# EAGLE design Arduino Arcade Stick (EAGLE 7.2.0)
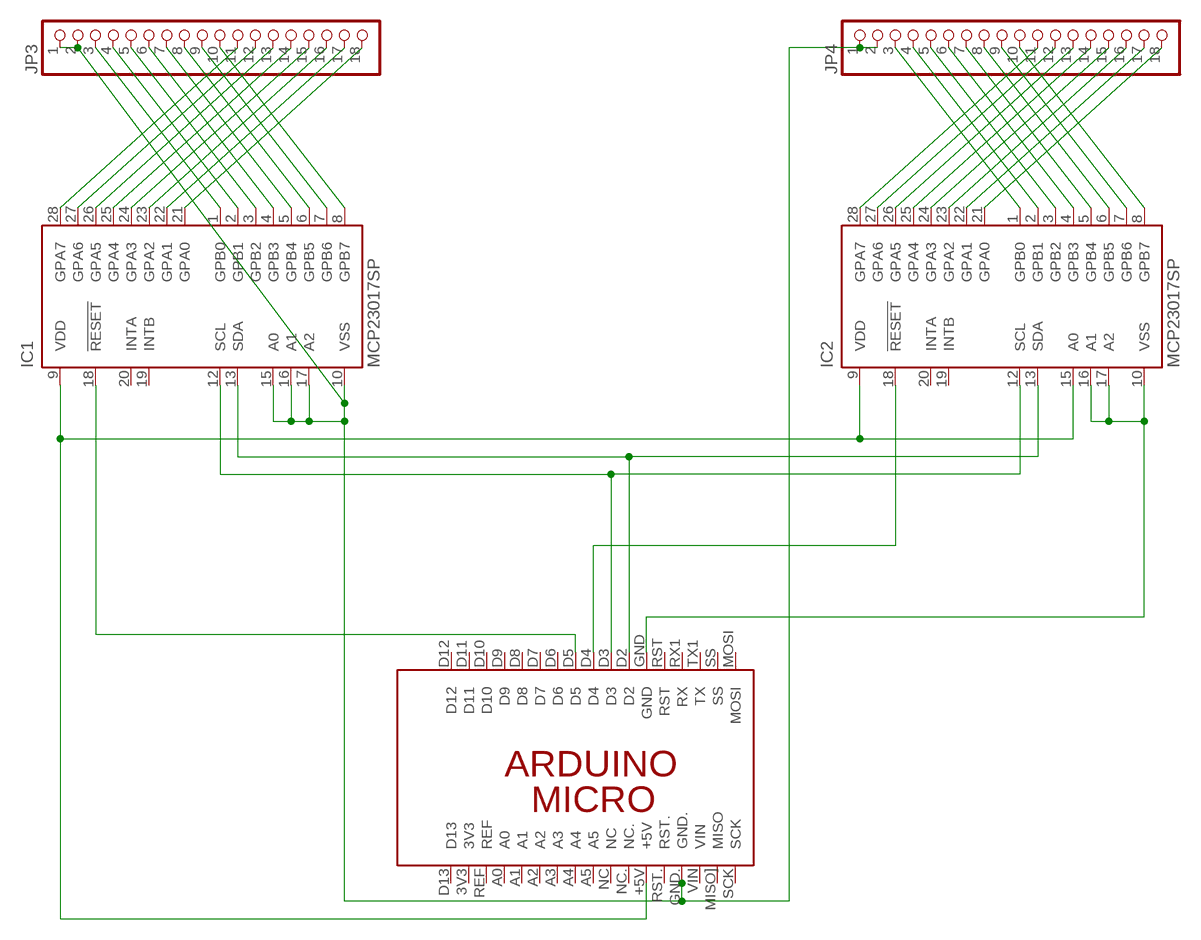
[diagram p0: schematic, sheet 1]

## Parts
IC1  MCP23017SP  [DIL28-3]
IC2  MCP23017SP  [DIL28-3]
JP3  PINHD-1X18  [1X18]
JP4  PINHD-1X18  [1X18]
PCB1  ARDUINO_MICRO  [ARDUINO_MICRO]

## Nets
N$1: IC1.21(GPA0) JP3.18
N$2: IC1.22(GPA1) JP3.17
N$3: IC1.23(GPA2) JP3.16
N$4: IC1.24(GPA3) JP3.15
N$5: IC1.25(GPA4) JP3.14
N$6: IC1.26(GPA5) JP3.13
N$7: IC1.27(GPA6) JP3.12
N$8: IC1.28(GPA7) JP3.11
N$9: IC1.8(GPB7) JP3.10
N$10: IC1.7(GPB6) JP3.9
N$11: IC1.6(GPB5) JP3.8
N$12: IC1.5(GPB4) JP3.7
N$13: IC1.4(GPB3) JP3.6
N$14: IC1.3(GPB2) JP3.5
N$15: IC1.2(GPB1) JP3.4
N$16: IC1.1(GPB0) JP3.3
N$17: IC2.21(GPA0) JP4.18
N$18: IC2.22(GPA1) JP4.17
N$19: IC2.23(GPA2) JP4.16
N$20: IC2.24(GPA3) JP4.15
N$21: IC2.25(GPA4) JP4.14
N$22: IC2.26(GPA5) JP4.13
N$23: IC2.27(GPA6) JP4.12
N$24: IC2.28(GPA7) JP4.11
N$25: IC2.8(GPB7) JP4.10
N$26: IC2.7(GPB6) JP4.9
N$27: IC2.6(GPB5) JP4.8
N$28: IC2.5(GPB4) JP4.7
N$29: IC2.4(GPB3) JP4.6
N$30: IC2.3(GPB2) JP4.5
N$31: IC2.2(GPB1) JP4.4
N$32: IC2.1(GPB0) JP4.3
N$33: IC2.18(!RESET) PCB1.D4
N$34: IC1.13(SDA) IC2.13(SDA) PCB1.D2
N$36: IC1.12(SCL) IC2.12(SCL) PCB1.D3
N$38: IC1.18(!RESET) PCB1.D5
VDD: IC1.9(VDD) IC2.9(VDD) IC2.15(A0) PCB1.+5V
VSS: IC1.10(VSS) IC1.15(A0) IC1.16(A1) IC1.17(A2) IC2.10(VSS) IC2.16(A1) IC2.17(A2) JP3.1 JP3.2 JP4.1 JP4.2 PCB1.GND PCB1.GND.
Unconnected: IC1.19(INTB) IC1.20(INTA) IC2.19(INTB) IC2.20(INTA) PCB1.3V3 PCB1.A0 PCB1.A1 PCB1.A2 PCB1.A3 PCB1.A4 PCB1.A5 PCB1.D6 PCB1.D7 PCB1.D8 PCB1.D9 PCB1.D10 PCB1.D11 PCB1.D12 PCB1.D13 PCB1.MISO](MISO) PCB1.MOSI PCB1.NC PCB1.NC. PCB1.REF PCB1.RST PCB1.RST. PCB1.RX1(RX) PCB1.SCK PCB1.SS PCB1.TX1(TX) PCB1.VIN

## Library data of the parts
IC1 IC2 = adafruit:MCP23017: http://ww1.microchip.com/downloads/en/DeviceDoc/21952a.pdf Source: http://ww1.microchip.com/downloads/en/DeviceDoc/21952a.pdf
JP3 JP4 = adafruit:PINHD-1X18: PIN HEADER
PCB1 = E14_Arduino_published:ARDUINO_MICRO: Device for representing an Arduino Micro board with a footprint in an EAGLE design. Created by Dave Young for Element14. More EAGLE documentation at: http://www.element14.com/community/community/knode/cadsoft_eagle

## Board
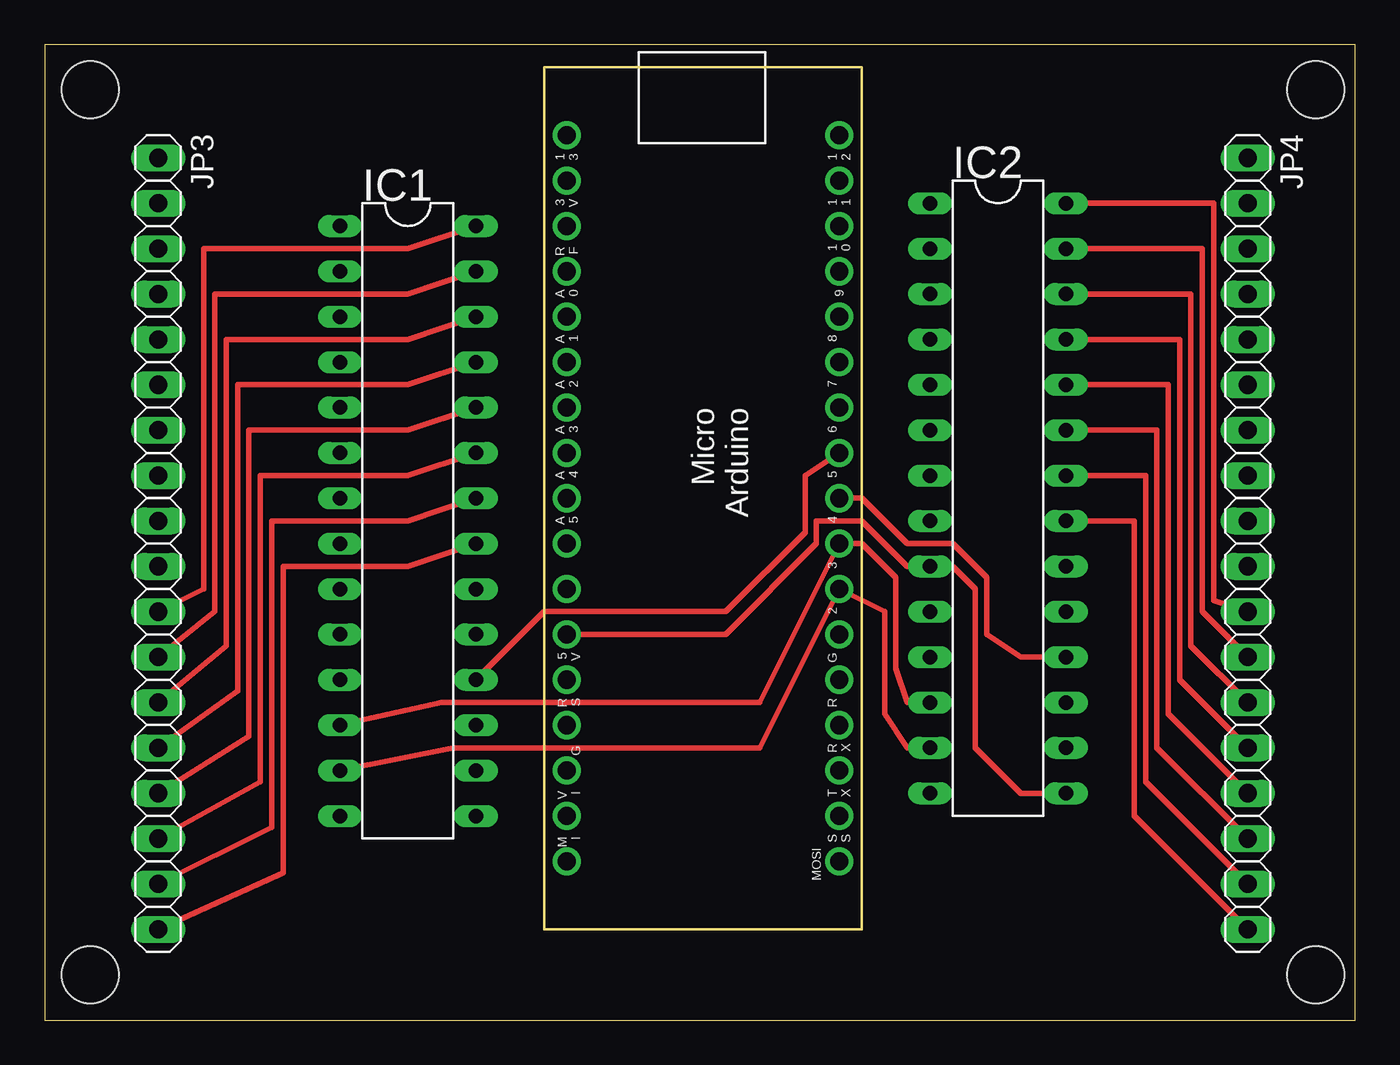
[diagram p1: board, top side]
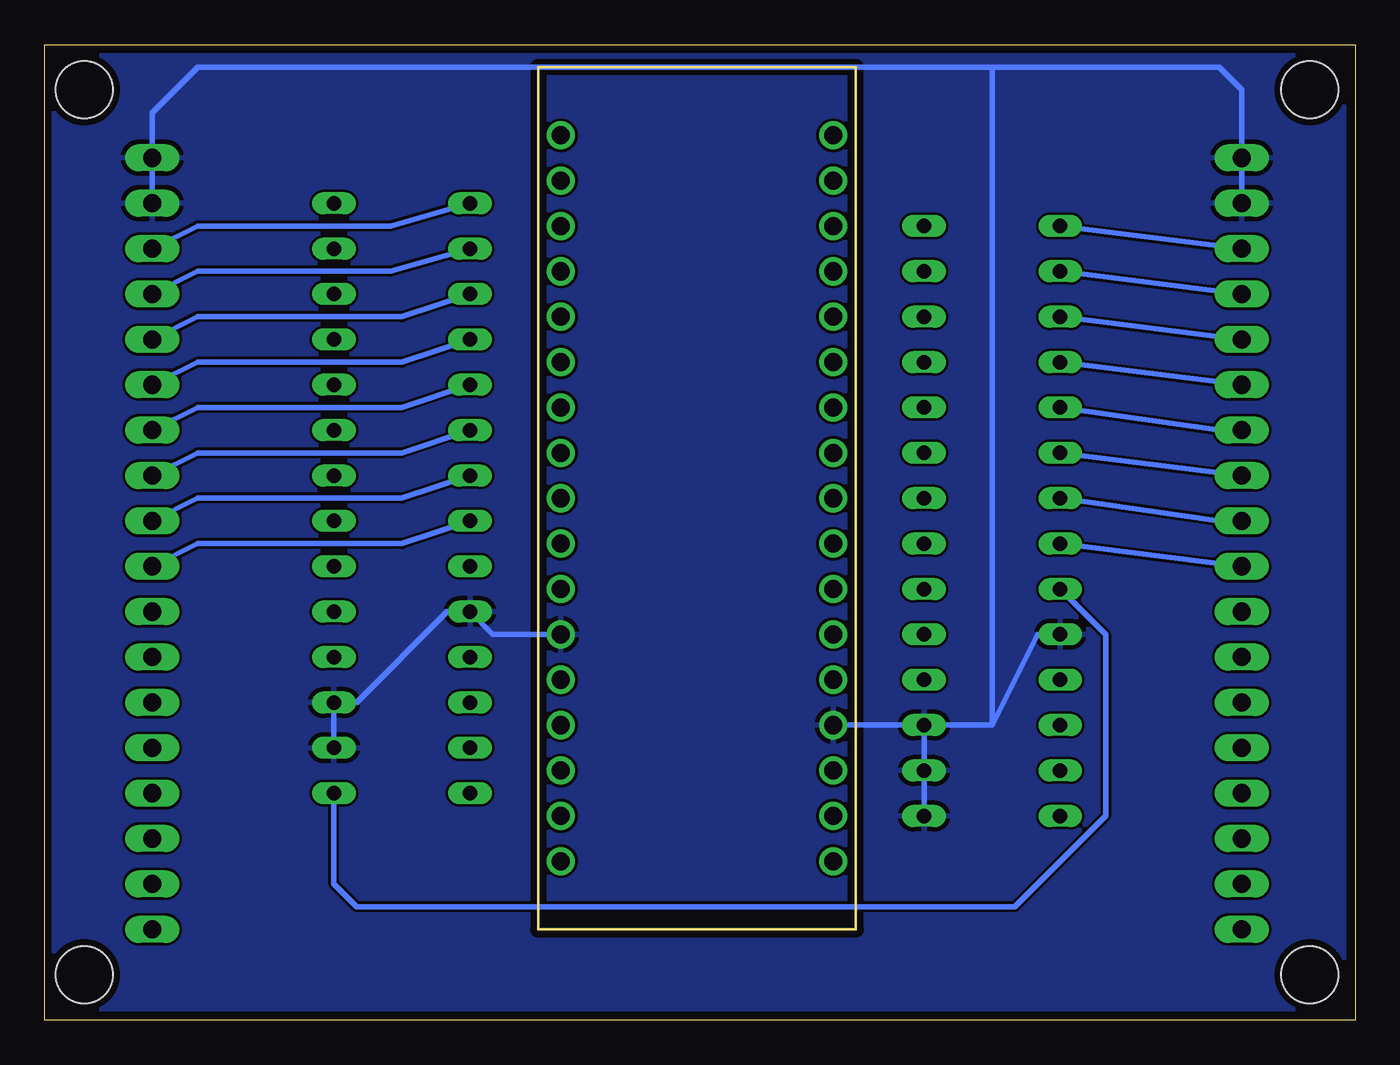
[diagram p2: board, bottom side, seen from below]

Size 73.33 x 54.6 mm. Coordinates in mm from the lower left corner, seen from the top.
Outline: 0,0 73.33,0 73.33,54.6 0,54.6 0,0
Copper layers (1*16): Top 0.0356mm / dielectric 1.5011mm / Bottom 0.0356mm
Design rules "LaenPCBOrder": minimum track width 6mil, minimum drill 13mil, track to track 6mil, track to pad 6mil, pad to pad 6mil, via to via 6mil, smd to smd 6mil, copper to edge 15mil, drill to drill 6mil, minimum pad ring 7mil, minimum via ring 7mil, stop-mask expansion 3mil, vias tented up to drill 0mil, thermal gap 10mil
Holes 3.2 mm at 2.54,52.07 71.12,52.07 71.12,2.54 2.54,2.54

### Footprints (pad centres in the part's own frame; a part is rotated, then mirrored left to right if it is on the bottom)
DIL28-3 = drill 0.813 long: 1 -16.51,-3.81; 2 -13.97,-3.81; 3 -11.43,-3.81; 4 -8.89,-3.81; 5 -6.35,-3.81; 6 -3.81,-3.81; 7 -1.27,-3.81; 8 1.27,-3.81; 9 3.81,-3.81; 10 6.35,-3.81; 11 8.89,-3.81; 12 11.43,-3.81; 13 13.97,-3.81; 14 16.51,-3.81; 15 16.51,3.81; 16 13.97,3.81; 17 11.43,3.81; 18 8.89,3.81; 19 6.35,3.81; 20 3.81,3.81; 21 1.27,3.81; 22 -1.27,3.81; 23 -3.81,3.81; 24 -6.35,3.81; 25 -8.89,3.81; 26 -11.43,3.81; 27 -13.97,3.81; 28 -16.51,3.81
1X18 = drill 1.016 long: 1 -21.59,0; 2 -19.05,0; 3 -16.51,0; 4 -13.97,0; 5 -11.43,0; 6 -8.89,0; 7 -6.35,0; 8 -3.81,0; 9 -1.27,0; 10 1.27,0; 11 3.81,0; 12 6.35,0; 13 8.89,0; 14 11.43,0; 15 13.97,0; 16 16.51,0; 17 19.05,0; 18 21.59,0
ARDUINO_MICRO = drill 1.016 pad 1.575: 3V3 6.35,1.27; +5V 31.75,1.27; A0 11.43,1.27; A1 13.97,1.27; A2 16.51,1.27; A3 19.05,1.27; A4 21.59,1.27; A5 24.13,1.27; D2 29.21,16.51; D3 26.67,16.51; D4 24.13,16.51; D5 21.59,16.51; D6 19.05,16.51; D7 16.51,16.51; D8 13.97,16.51; D9 11.43,16.51; D10 8.89,16.51; D11 6.35,16.51; D12 3.81,16.51; D13 3.81,1.27; GND 31.75,16.51; GND. 36.83,1.27; MISO] 41.91,1.27; MOSI 44.45,16.51; NC 26.67,1.27; NC. 29.21,1.27; REF 8.89,1.27; RST 34.29,16.51; RST. 34.29,1.27; RX1 36.83,16.51; SCK 44.45,1.27; SS 41.91,16.51; TX1 39.37,16.51; VIN 39.37,1.27

### Placement (x,y rotation side)
IC1  20.32,27.94 270 top
IC2  53.34,29.21 270 top
JP3  6.35,26.67 270 top
JP4  67.31,26.67 270 top
PCB1  27.94,53.34 270 top

### Tracks (layer width: path | path; a pad name or v marks a point on that pad's centre or on a via)
N$1
  Top 0.305: IC1.21 20.32,25.4 13.34,25.4 13.34,8.26 JP3.18
N$2
  Top 0.305: IC1.22 20.32,27.94 12.7,27.94 12.7,10.79 JP3.17
N$3
  Top 0.305: IC1.23 20.32,30.48 12.06,30.48 12.06,13.34 JP3.16
N$4
  Top 0.305: IC1.24 20.32,33.02 11.43,33.02 11.43,15.88 JP3.15
N$5
  Top 0.305: IC1.25 20.32,35.56 10.79,35.56 10.79,18.41 JP3.14
N$6
  Top 0.305: IC1.26 20.32,38.1 10.16,38.1 10.16,20.95 JP3.13
N$7
  Top 0.305: IC1.27 20.32,40.64 9.53,40.64 9.53,22.86 JP3.12
N$8
  Top 0.305: IC1.28 20.32,43.18 8.89,43.18 8.89,24.13 JP3.11
N$9
  Bottom 0.305: IC1.8 JP3.10
N$10
  Bottom 0.305: JP3.9 7.62,27.94 IC1.7
N$11
  Bottom 0.305: IC1.6 JP3.8
N$12
  Bottom 0.305: IC1.5 7.62,33.02 JP3.7
N$13
  Bottom 0.305: IC1.4 JP3.6
N$14
  Bottom 0.305: IC1.3 JP3.5
N$15
  Bottom 0.305: IC1.2 JP3.4
N$16
  Bottom 0.305: IC1.1 JP3.3
N$17
  Top 0.305: IC2.21 60.96,27.94 60.96,11.43 JP4.18
N$18
  Top 0.305: IC2.22 61.59,30.48 61.59,13.34 JP4.17
N$19
  Top 0.305: IC2.23 62.23,33.02 62.23,15.24 JP4.16
N$20
  Top 0.305: IC2.24 62.87,35.56 62.87,17.14 JP4.15
N$21
  Top 0.305: IC2.25 63.5,38.1 63.5,19.05 JP4.14
N$22
  Top 0.305: IC2.26 64.14,40.64 64.14,20.95 JP4.13
N$23
  Top 0.305: IC2.27 64.77,43.18 64.77,22.86 JP4.12
N$24
  Top 0.305: IC2.28 65.41,45.72 65.41,23.5 JP4.11
N$25
  Bottom 0.305: IC2.8 53.34,26.67 64.77,26.67 JP4.10
N$26
  Bottom 0.305: IC2.7 53.34,29.21 64.77,29.21 JP4.9
N$27
  Bottom 0.305: IC2.6 53.34,31.75 64.77,31.75 JP4.8
N$28
  Bottom 0.305: IC2.5 53.34,34.29 64.77,34.29 JP4.7
N$29
  Bottom 0.305: IC2.4 53.34,36.83 64.77,36.83 JP4.6
N$30
  Bottom 0.305: IC2.3 53.34,39.37 64.77,39.37 JP4.5
N$31
  Bottom 0.305: IC2.2 53.98,41.91 64.77,41.91 JP4.4
N$32
  Bottom 0.305: IC2.1 53.98,44.45 64.77,44.45 JP4.3
N$33
  Top 0.305: IC2.18 54.61,20.32 52.7,21.59 52.7,24.77 50.8,26.67 48.26,26.67 45.72,29.21 PCB1.D4
N$34
  Top 0.305: IC1.13 22.86,15.24 40.01,15.24 PCB1.D2 46.99,22.86 46.99,17.14 48.26,15.24 IC2.13
N$36
  Top 0.305: IC1.12 22.23,17.78 40.01,17.78 PCB1.D3 45.72,26.67 47.62,24.77 47.62,19.68 48.26,17.78 IC2.12
N$38
  Top 0.305: IC1.18 27.94,22.86 38.1,22.86 42.55,27.3 42.55,30.48 PCB1.D5
VDD
  Top 0.305: PCB1.+5V 38.1,21.59 43.18,26.67 43.18,27.94 45.72,27.94 48.26,25.4 IC2.9 50.8,25.4 52.07,24.13 52.07,15.24 54.61,12.7 IC2.15
  Bottom 0.305: IC1.9 13.97,21.59 13.97,11.43 19.05,6.35 55.88,6.35 57.15,7.62 IC2.15
VSS
  Bottom 0.305: 20.32,53.34 64.77,53.34 67.31,50.8 JP4.1 JP4.2 | IC1.10 17.78,21.59 20.32,16.51 | IC1.15 IC1.16 IC1.17 | JP3.2 JP3.1 6.35,52.07 7.62,53.34 20.32,53.34 | 20.32,53.34 20.32,16.51 | 20.32,16.51 PCB1.GND. | PCB1.GND 48.26,21.59 IC2.10 50.8,22.86 55.88,17.78 IC2.17 IC2.16
  pour Bottom: 0.64,53.98 73.03,53.98 73.03,0.64 0.64,0.64